# Altium schematic sheet [1] Supply.SchDoc
size A4
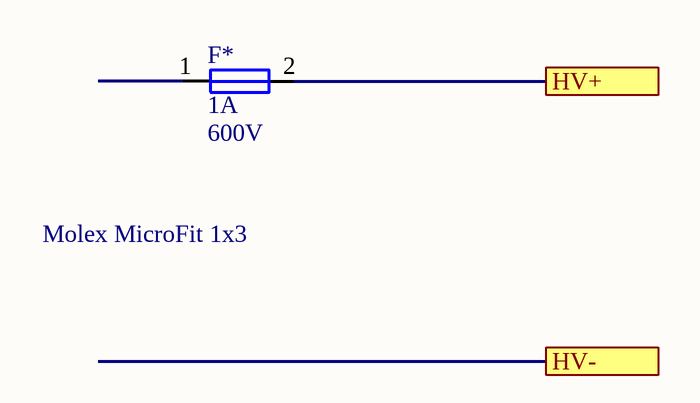
[diagram p0: [1] Supply.SchDoc]

## Parts
F*  Current Rating: 1A  Voltage Rating: 600V  (hidden comment: 485001)

## Ports
HV+, HV-

## Nets
HV+: F*.2 ; port HV+

Not connected (* = marked no-connect by the designer): F* 1

## Notes on the sheet
- Molex MicroFit 1x3
- Title
- Size:
- Date:
- A4
- Number:
- Time:
- Revision:
- Sheet
- of
- File:

## Library data of the parts
F* = F-1A-600V-FOOTPRINT?: Surface Mount Fuses 600V 1A Fast Acting; Manufacturer 1: Littelfuse; Manufacturer Part Number 1: 0485001.DR; Body Material: Ceramic; Voltage Rating (AC): 250V; Resistance: 264mR; DC Cold Resistance: 304.4mR; Fuse Type: Board Mount (Cartridge Style Excluded); Approvals: UL,CSA; ComponentLink1Description: Datasheet; ComponentLink1URL: https://www.littelfuse.com/media?resourcetype=datasheets&itemid=c1362005-f6d3-4b57-80ac-21c977bad216&filename=littelfuse-fuse-485-datasheet; ComponentLink2Description: Where buy it; ComponentLink2URL: https://www.littelfuse.com/products/fuses/surface-mount-fuses/nano-2-fuses/485/485001.aspx; Supplier 1: RSComponents; RoHS: Yes; Category: Fuses; Stock 1: 1; Pricing 1: 1=5175,15300 (USD); Mount: Surface Mount; Case/Package: SMD/SMT; Housing Material: Ceramic; Min Operating Temperature: -55°C; Max Operating Temperature: 125°C; Packaging: Tape and Reel; Termination: SMD/SMT; Package Quantity: 1; Series: 485; Voltage Rating (DC): 600V; Fuse Current: 1A; Length: 12.1mm; Width: 0.177inch; Height: 0.177inch; Depth: 4.5mm; RoHS Compliant: Yes; REACH SVHC: No SVHC; Lead Free: Lead Free; ComponentLink3URL: http://www.farnell.com/datasheets/1945989.pdf?src-supplier=Farnell; ComponentLink3Description: http://www.farnell.com/datasheets/1945989.pdf?src-supplier=Farnell; ComponentLink4URL: http://www.farnell.com/datasheets/2282568.pdf?src-supplier=Farnell; ComponentLink4Description: http://www.farnell.com/datasheets/2282568.pdf?src-supplier=Farnell; ComponentLink5URL: http://www.mouser.com/ds/2/240/Littelfuse485_datasheet_080512-201879.pdf?src-supplier=Mouser; ComponentLink5Description: http://www.mouser.com/ds/2/240/Littelfuse485_datasheet_080512-201879.pdf?src-supplier=Mouser; ComponentLink6URL: http://components.arrow.com/part/dataview/56707787S790276N3675?src-supplier=Arrow+Electronics; ComponentLink6Description: http://components.arrow.com/part/dataview/56707787S790276N3675?src-supplier=Arrow+Electronics; ComponentLink7URL: http://www.littelfuse.com/~/media/Files/Littelfuse/Technical%20Resources/Documents/Data%20Sheets/Littelfuse_Fuse_485_Datasheet.pdf?src-supplier=Element14; ComponentLink7Description: http://www.littelfuse.com/~/media/Files/Littelfuse/Technical%20Resources/Documents/Data%20Sheets/Littelfuse_Fuse_485_Datasheet.pdf?src-supplier=Element14; ComponentLink8URL: http://www.littelfuse.com/~/media/electronics/datasheets/fuses/littelfuse_fuse_485_datasheet.pdf.pdf?src-supplier=Digi-Key; ComponentLink8Description: http://www.littelfuse.com/~/media/electronics/datasheets/fuses/littelfuse_fuse_485_datasheet.pdf.pdf?src-supplier=Digi-Key; Supplier Part Number 1: 1740308